# EAGLE design PIN2DMD-v3.0 (EAGLE 7.4.0)
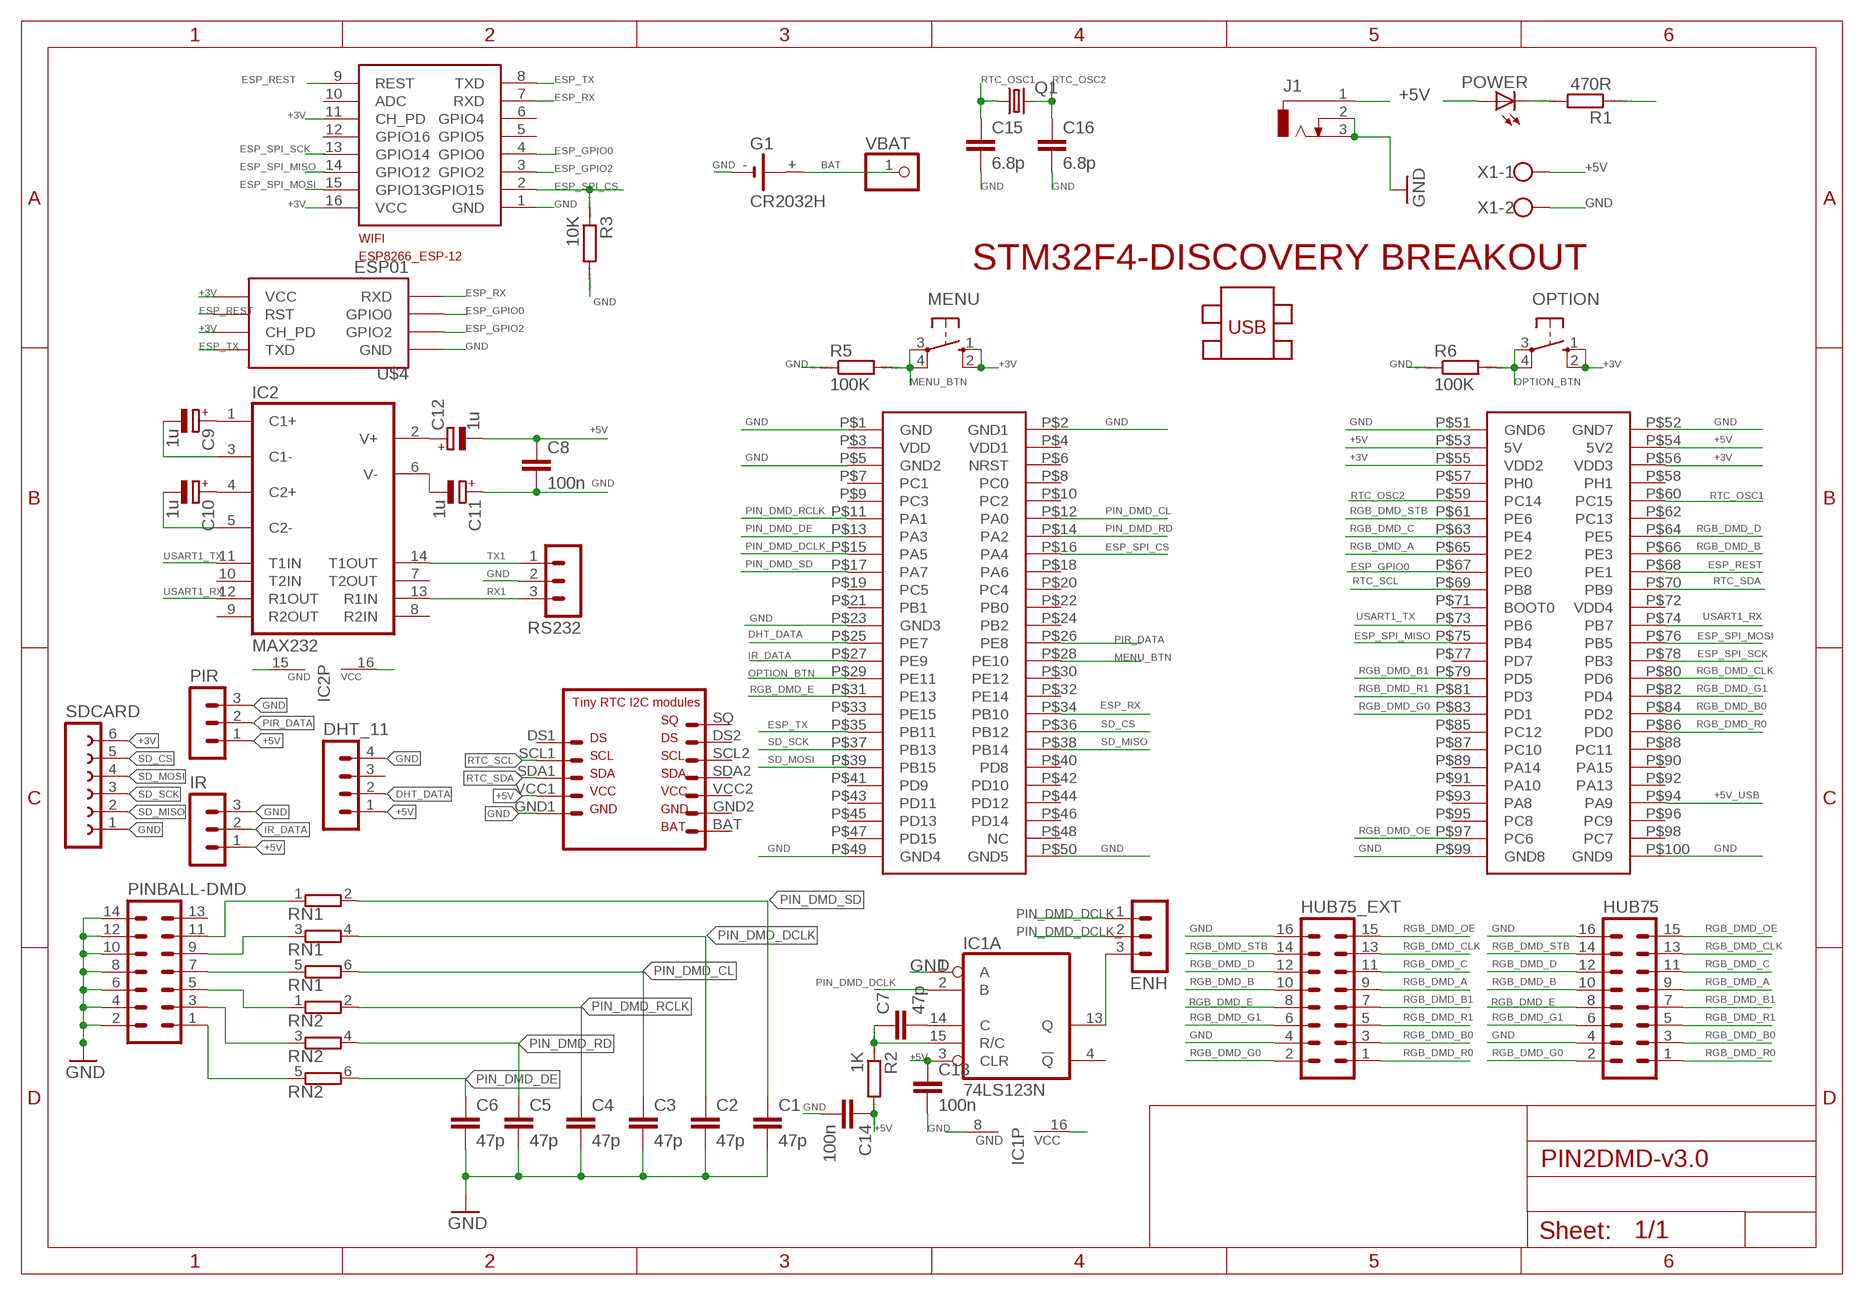
[diagram p0: schematic, sheet 1]

## Parts
C1  47p  C-EU025-024X044  [C025-024X044]
C2  47p  C-EU025-024X044  [C025-024X044]
C3  47p  C-EU025-024X044  [C025-024X044]
C4  47p  C-EU025-024X044  [C025-024X044]
C5  47p  C-EU025-024X044  [C025-024X044]
C6  47p  C-EU025-024X044  [C025-024X044]
C7  47p  C-EU025-024X044  [C025-024X044]
C8  100n  C-EU025-024X044  [C025-024X044]
C9  1u  CPOL-EUE2-4  [E2-4]
C10  1u  CPOL-EUE2-4  [E2-4]
C11  1u  CPOL-EUE2-4  [E2-4]
C12  1u  CPOL-EUE2-4  [E2-4]
C13  100n  C-EU025-024X044  [C025-024X044]
C14  100n  C-EU025-024X044  [C025-024X044]
C15  6.8p  C-EU025-024X044  [C025-024X044]
C16  6.8p  C-EU025-024X044  [C025-024X044]
DHT_11  MA04-1  [MA04-1]
ENH  MA03-1  [MA03-1]
G1  CR2032H  [CR2032H]
HUB75  MA08-2  [MA08-2]
HUB75_EXT  MA08-2  [MA08-2]
IC1  74LS123N  [DIL16]
IC2  MAX232  [DIL16]
IR  MA03-1  [MA03-1]
J1  DCJ0303  [DCJ0303]
MENU  10-XX  [B3F-10XX]
OPTION  10-XX  [B3F-10XX]
PINBALL-DMD  MA07-2  [MA07-2]
PIR  MA03-1  [MA03-1]
POWER  LED3MM  [LED3MM]
Q1  CRYSTALTC38H  [TC38H]
R1  470R  R0207/10  [0207/10]
R2  1K  R0207/10  [0207/10]
R3  10K  R0207/10  [0207/10]
R5  100K  R0207/10  [0207/10]
R6  100K  R0207/10  [0207/10]
RN1  E3RP  [SIL6]
RN2  E3RP  [SIL6]
RS232  MA03-1  [MA03-1]
SDCARD  FE06-1  [FE06]
U$1  STM32F4-DISCOVERY  [STM32F4-DISCOVERY]
U$3  RTC  [RTC]
U$4  ESP01  [ESP01]
VBAT  PINHD-1X1  [1X01]
WIFI  ESP8266_ESP-12  [ESP8266-ESP12]
X1  W237-102  [W237-102]

## Nets
+3V: MENU.1(S) MENU.2(S1) OPTION.1(S) OPTION.2(S1) SDCARD.6 U$1.P$55(VDD2) U$1.P$56(VDD3) U$4.CH_PD U$4.VCC WIFI.11(CH_PD) WIFI.16(VCC)
+5V: C8.1 C12.- C13.1 C14.1 DHT_11.1 IC1.3(A:CLR) IC1.16(P:VCC) IC2.16(VCC) IR.1 J1.1 PIR.1 POWER.A R2.2 U$1.P$53(5V) U$1.P$54(5V2) U$3.VCC1 X1.1
+5V_USB: U$1.P$94(PA9)
BAT: G1.+ VBAT.1
DHT_DATA: DHT_11.2 U$1.P$25(PE7)
ESP_GPIO0: U$1.P$67(PE0) U$4.GPIO0 WIFI.4(GPIO0)
ESP_GPIO2: U$4.GPIO2 WIFI.3(GPIO2)
ESP_REST: U$1.P$68(PE1) U$4.RST WIFI.9(REST)
ESP_RX: U$1.P$34(PB10) U$4.RX(RXD) WIFI.7(RXD)
ESP_SPI_CS: R3.1 U$1.P$16(PA4) WIFI.2(GPIO15)
ESP_SPI_MISO: U$1.P$75(PB4) WIFI.14(GPIO12)
ESP_SPI_MOSI: U$1.P$76(PB5) WIFI.15(GPIO13)
ESP_SPI_SCK: U$1.P$78(PB3) WIFI.13(GPIO14)
ESP_TX: U$1.P$35(PB11) U$4.TX(TXD) WIFI.8(TXD)
GND: C1.2 C2.2 C3.2 C4.2 C5.2 C6.2 C8.2 C11.+ C13.2 C14.2 C15.2 C16.2 DHT_11.4 G1.- HUB75.4 HUB75.16 HUB75_EXT.4 HUB75_EXT.16 IC1.1(A:A) IC1.8(P:GND) IC2.15(GND) IR.3 J1.2 J1.3 PINBALL-DMD.2 PINBALL-DMD.4 PINBALL-DMD.6 PINBALL-DMD.8 PINBALL-DMD.10 PINBALL-DMD.12 PINBALL-DMD.14 PIR.3 R1.1 R3.2 R5.1 R6.1 RS232.2 SDCARD.1 U$1.P$1(GND) U$1.P$2(GND1) U$1.P$5(GND2) U$1.P$23(GND3) U$1.P$49(GND4) U$1.P$50(GND5) U$1.P$51(GND6) U$1.P$52(GND7) U$1.P$99(GND8) U$1.P$100(GND9) U$3.GND1 U$4.GND WIFI.1(GND) X1.2
IR_DATA: IR.2 U$1.P$27(PE9)
MENU_BTN: MENU.3(P) MENU.4(P1) R5.2 U$1.P$28(PE10)
N$1: POWER.K(C) R1.2
N$2: C7.1 IC1.15(A:R/C) R2.1
N$3: C7.2 IC1.14(A:C)
N$4: C9.+ IC2.1(C1+)
N$5: PINBALL-DMD.7 RN1.5
N$6: PINBALL-DMD.5 RN2.1
N$7: C10.+ IC2.4(C2+)
N$8: C11.- IC2.6(V-)
N$9: C9.- IC2.3(C1-)
N$10: C10.- IC2.5(C2-)
N$11: PINBALL-DMD.3 RN2.3
N$12: PINBALL-DMD.1 RN2.5
N$13: PINBALL-DMD.9 RN1.3
N$14: PINBALL-DMD.11 RN1.1
N$16: C12.+ IC2.2(V+)
N$17: ENH.3 IC1.13(A:Q)
OPTION_BTN: OPTION.3(P) OPTION.4(P1) R6.2 U$1.P$29(PE11)
PIN_DMD_CL: C3.1 RN1.6 U$1.P$12(PA0)
PIN_DMD_DCLK: C2.1 ENH.1 IC1.2(A:B) RN1.4
PIN_DMD_DCLK_: ENH.2 U$1.P$15(PA5)
PIN_DMD_DE: C6.1 RN2.6 U$1.P$13(PA3)
PIN_DMD_RCLK: C4.1 RN2.2 U$1.P$11(PA1)
PIN_DMD_RD: C5.1 RN2.4 U$1.P$14(PA2)
PIN_DMD_SD: C1.1 RN1.2 U$1.P$17(PA7)
PIR_DATA: PIR.2 U$1.P$26(PE8)
RGB_DMD_A: HUB75.9 HUB75_EXT.9 U$1.P$65(PE2)
RGB_DMD_B: HUB75.10 HUB75_EXT.10 U$1.P$66(PE3)
RGB_DMD_B0: HUB75.3 HUB75_EXT.3 U$1.P$84(PD2)
RGB_DMD_B1: HUB75.7 HUB75_EXT.7 U$1.P$79(PD5)
RGB_DMD_C: HUB75.11 HUB75_EXT.11 U$1.P$63(PE4)
RGB_DMD_CLK: HUB75.13 HUB75_EXT.13 U$1.P$80(PD6)
RGB_DMD_D: HUB75.12 HUB75_EXT.12 U$1.P$64(PE5)
RGB_DMD_E: HUB75.8 HUB75_EXT.8 U$1.P$31(PE13)
RGB_DMD_G0: HUB75.2 HUB75_EXT.2 U$1.P$83(PD1)
RGB_DMD_G1: HUB75.6 HUB75_EXT.6 U$1.P$82(PD4)
RGB_DMD_OE: HUB75.15 HUB75_EXT.15 U$1.P$97(PC6)
RGB_DMD_R0: HUB75.1 HUB75_EXT.1 U$1.P$86(PD0)
RGB_DMD_R1: HUB75.5 HUB75_EXT.5 U$1.P$81(PD3)
RGB_DMD_STB: HUB75.14 HUB75_EXT.14 U$1.P$61(PE6)
RTC_OSC1: C15.1 Q1.1 U$1.P$60(PC15)
RTC_OSC2: C16.1 Q1.2 U$1.P$59(PC14)
RTC_SCL: U$1.P$69(PB8) U$3.SCL1
RTC_SDA: U$1.P$70(PB9) U$3.SDA1
RX1: IC2.13(R1IN) RS232.3
SD_CS: SDCARD.5 U$1.P$36(PB12)
SD_MISO: SDCARD.2 U$1.P$38(PB14)
SD_MOSI: SDCARD.4 U$1.P$39(PB15)
SD_SCK: SDCARD.3 U$1.P$37(PB13)
TX1: IC2.14(T1OUT) RS232.1
USART1_RX: IC2.12(R1OUT) U$1.P$74(PB7)
USART1_TX: IC2.11(T1IN) U$1.P$73(PB6)
Unconnected: DHT_11.3 G1.+@1(+) IC1.4(A:!Q) IC1.5(B:Q) IC1.6(B:C) IC1.7(B:R/C) IC1.9(B:A) IC1.10(B:B) IC1.11(B:CLR) IC1.12(B:!Q) IC2.7(T2OUT) IC2.8(R2IN) IC2.9(R2OUT) IC2.10(T2IN) PINBALL-DMD.13 U$1.P$3(VDD) U$1.P$4(VDD1) U$1.P$6(NRST) U$1.P$7(PC1) U$1.P$8(PC0) U$1.P$9(PC3) U$1.P$10(PC2) U$1.P$18(PA6) U$1.P$19(PC5) U$1.P$20(PC4) U$1.P$21(PB1) U$1.P$22(PB0) U$1.P$24(PB2) U$1.P$30(PE12) U$1.P$32(PE14) U$1.P$33(PE15) U$1.P$40(PD8) U$1.P$41(PD9) U$1.P$42(PD10) U$1.P$43(PD11) U$1.P$44(PD12) U$1.P$45(PD13) U$1.P$46(PD14) U$1.P$47(PD15) U$1.P$48(NC) U$1.P$57(PH0) U$1.P$58(PH1) U$1.P$62(PC13) U$1.P$71(BOOT0) U$1.P$72(VDD4) U$1.P$77(PD7) U$1.P$85(PC12) U$1.P$87(PC10) U$1.P$88(PC11) U$1.P$89(PA14) U$1.P$90(PA15) U$1.P$91(PA10) U$1.P$92(PA13) U$1.P$93(PA8) U$1.P$95(PC8) U$1.P$96(PC9) U$1.P$98(PC7) U$3.BAT U$3.DS1 U$3.DS2 U$3.GND2 U$3.SCL2 U$3.SDA2 U$3.SQ U$3.VCC2 WIFI.5(GPIO5) WIFI.6(GPIO4) WIFI.10(ADC) WIFI.12(GPIO16)

## Library data of the parts
C1-C8 C13-C16 = resistor:C-EU: CAPACITOR, European symbol
C9-C12 = resistor:CPOL-EU: POLARIZED CAPACITOR, European symbol
DHT_11 = con-lstb:MA04-1: PIN HEADER; OC_FARNELL: unknown; OC_NEWARK: unknown
ENH IR PIR RS232 = con-lstb:MA03-1: PIN HEADER; OC_FARNELL: unknown; OC_NEWARK: unknown
G1 = battery:CR2032H: LI BATTERY Varta
HUB75 HUB75_EXT = con-lstb:MA08-2: PIN HEADER; OC_FARNELL: unknown; OC_NEWARK: unknown
IC1 = 74xx-eu:74*123: Retriggerable monostable MULTIVIBRATOR
IC2 = maxim:MAX232: RS232 TRANSCEIVER; MF: MAXIM; MPN: MAX232ACPE+; OC_FARNELL: 9723773; OC_NEWARK: 68K4544
J1 = con-jack:DCJ0303: DC POWER JACK Source: DCJ0303.pdf; OC_FARNELL: unknown; OC_NEWARK: unknown
MENU OPTION = switch-omron:10-XX: OMRON SWITCH; MPN: B3F-1000; OC_FARNELL: 176432; OC_NEWARK: 36M3542
PINBALL-DMD = con-lstb:MA07-2: PIN HEADER
POWER = led:LED: LED OSRAM: - CHIPLED LG R971, LG N971, LY N971, LG Q971, LY Q971, LO R971, LY R971 LH N974, LH R974 LS Q976, LO Q976, LY Q976 LO Q996 - Hyper CHIPLED LW Q18S LB Q993, LB Q99A, LB R99A - SideLED LS A670, LO A670, LY A670, LG A670, LP A670 LB A673, LV A673, LT A673, LW A673 LH A674 LY A675 LS A676, LA A676, LO A676, LY A676, LW A676 LS A679, LY A679, LG A679 - Hyper Micro SIDELED® LS Y876, LA Y876, LO Y876, LY Y876 LT Y87S - SmartLED LW L88C, LW L88S LB L89C, LB L89S, LG L890 LS L89K, LO L89K, LY L89K LS L896, LA L896, LO L896, LY L896 - TOPLED LS T670, LO T670, LY T670, LG T670, LP T670 LSG T670, LSP T670, LSY T670, LOP T670, LYG T670 LG T671, LOG T671, LSG T671 LB T673, LV T673, LT T673, LW T673 LH T674 LS T676, LA T676, LO T676, LY T676, LB T676, LH T676, LSB T676, LW T676 LB T67C, LV T67C, LT T67C, LS T67K, LO T67K, LY T67K, LW E67C LS E67B, LA E67B, LO E67B, LY E67B, LB E67C, LV E67C, LT E67C LW T67C LS T679, LY T679, LG T679 LS T770, LO T770, LY T770, LG T770, LP T770 LB T773, LV T773, LT T773, LW T773 LH T774 LS E675, LA E675, LY E675, LS T675 LS T776, LA T776, LO T776, LY T776, LB T776 LHGB T686 LT T68C, LB T68C - Hyper Mini TOPLED® LB M676 - Mini TOPLED Santana® LG M470 LS M47K, LO M47K, LY M47K Source: http://www.osram.convergy.de LUXEON: - LUMILED® LXK2-PW12-R00, LXK2-PW12-S00, LXK2-PW14-U00, LXK2-PW14-V00 LXK2-PM12-R00, LXK2-PM12-S00, LXK2-PM14-U00 LXK2-PE12-Q00, LXK2-PE12-R00, LXK2-PE12-S00, LXK2-PE14-T00, LXK2-PE14-U00 LXK2-PB12-K00, LXK2-PB12-L00, LXK2-PB12-M00, LXK2-PB14-N00, LXK2-PB14-P00, LXK2-PB14-Q00 LXK2-PR12-L00, LXK2-PR12-M00, LXK2-PR14-Q00, LXK2-PR14-R00 LXK2-PD12-Q00, LXK2-PD12-R00, LXK2-PD12-S00 LXK2-PH12-R00, LXK2-PH12-S00 LXK2-PL12-P00, LXK2-PL12-Q00, LXK2-PL12-R00 Source: www.luxeon.com KINGBRIGHT: KA-3528ASYC Source: www.kingbright.com
Q1 = crystal:CRYSTAL: CRYSTAL; OC_FARNELL: unknown; OC_NEWARK: unknown
R1-R3 R5 R6 = eagle-ltspice:R: RESISTOR, European symbol; SPICEMODEL: NONE; SPICEPREFIX: R
RN1 RN2 = resistor-sil:E3RP: SIL RESISTOR; OC_FARNELL: unknown; OC_NEWARK: unknown
SDCARD = con-lsta:FE06-1: FEMALE HEADER; OC_FARNELL: unknown; OC_NEWARK: unknown
U$1 = STM32F4-DISCOVERY:STM32F4-DISCOVERY
U$3 = RTC:RTC
U$4 = esp8266modules:ESP01: ESP8266 Wifi module 01
VBAT = pinhead:PINHD-1X1: PIN HEADER
WIFI = ESP8266-ESP12:ESP8266_ESP-12
X1 = con-wago-500:W237-102: WAGO SCREW CLAMP; MPN: 237-102; OC_FARNELL: unknown; OC_NEWARK: 70K9898

## Board
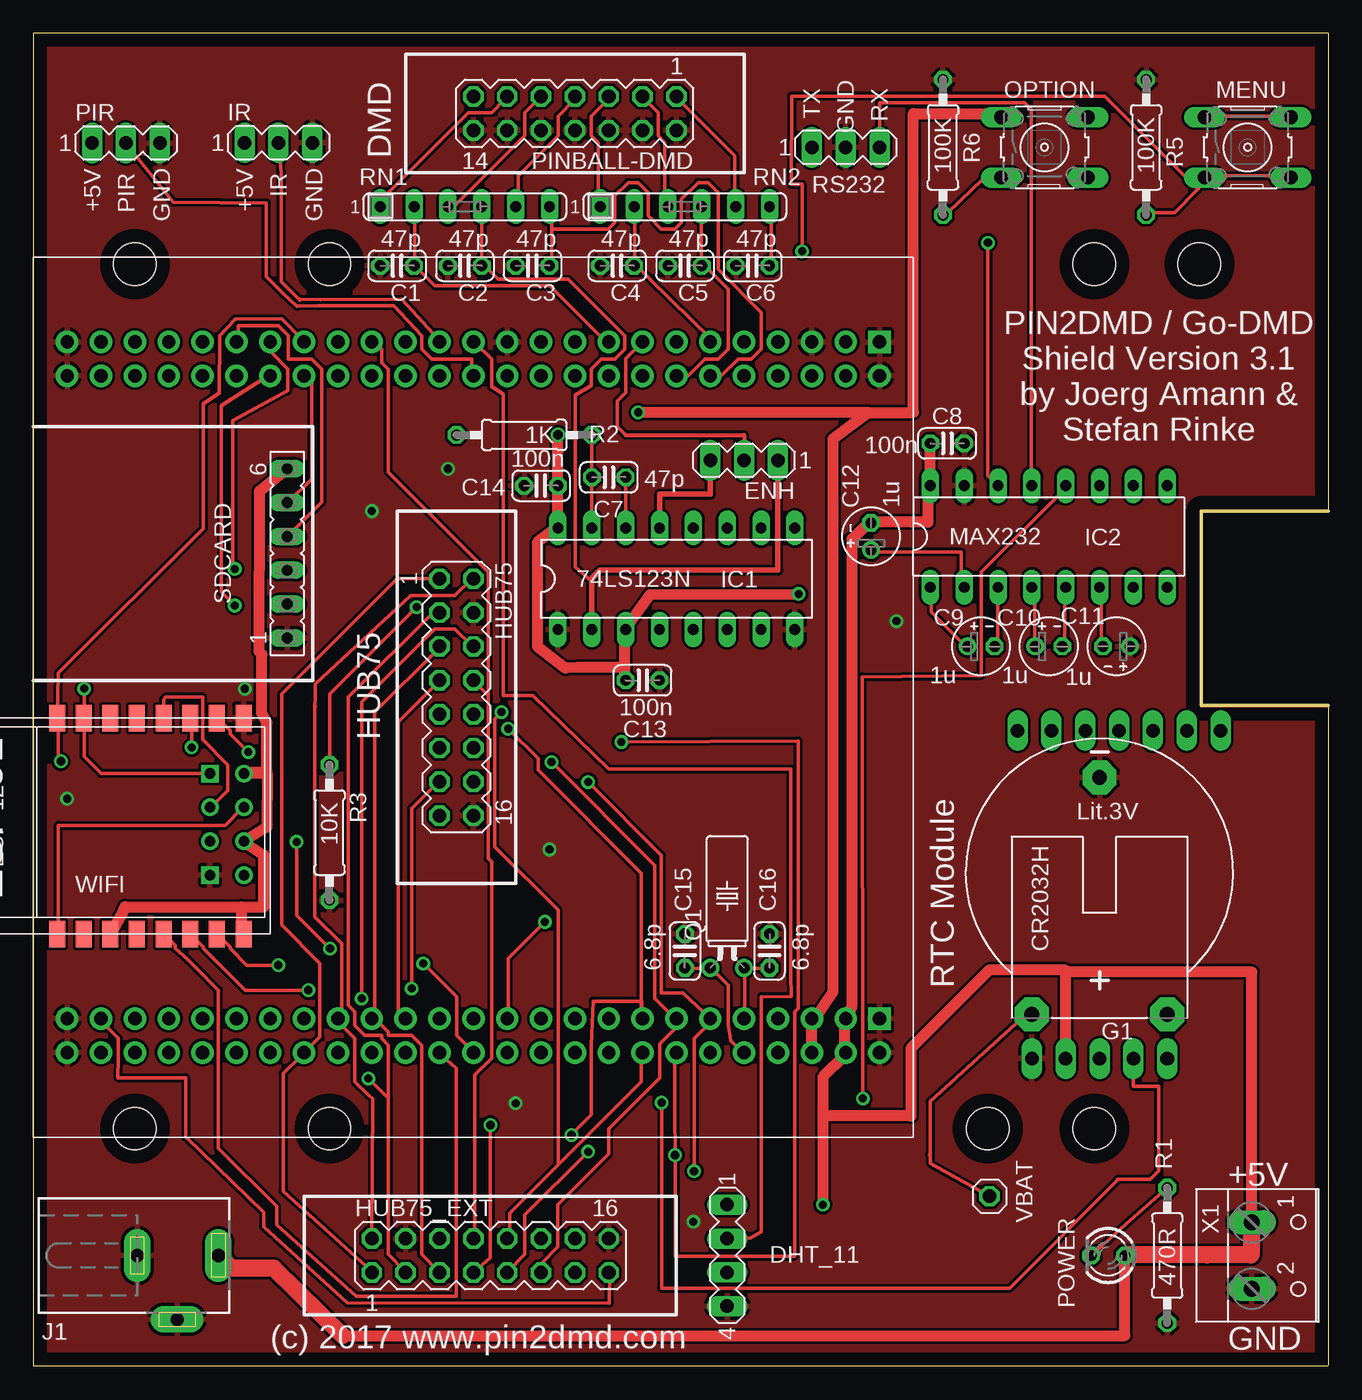
[diagram p1: board, top side]
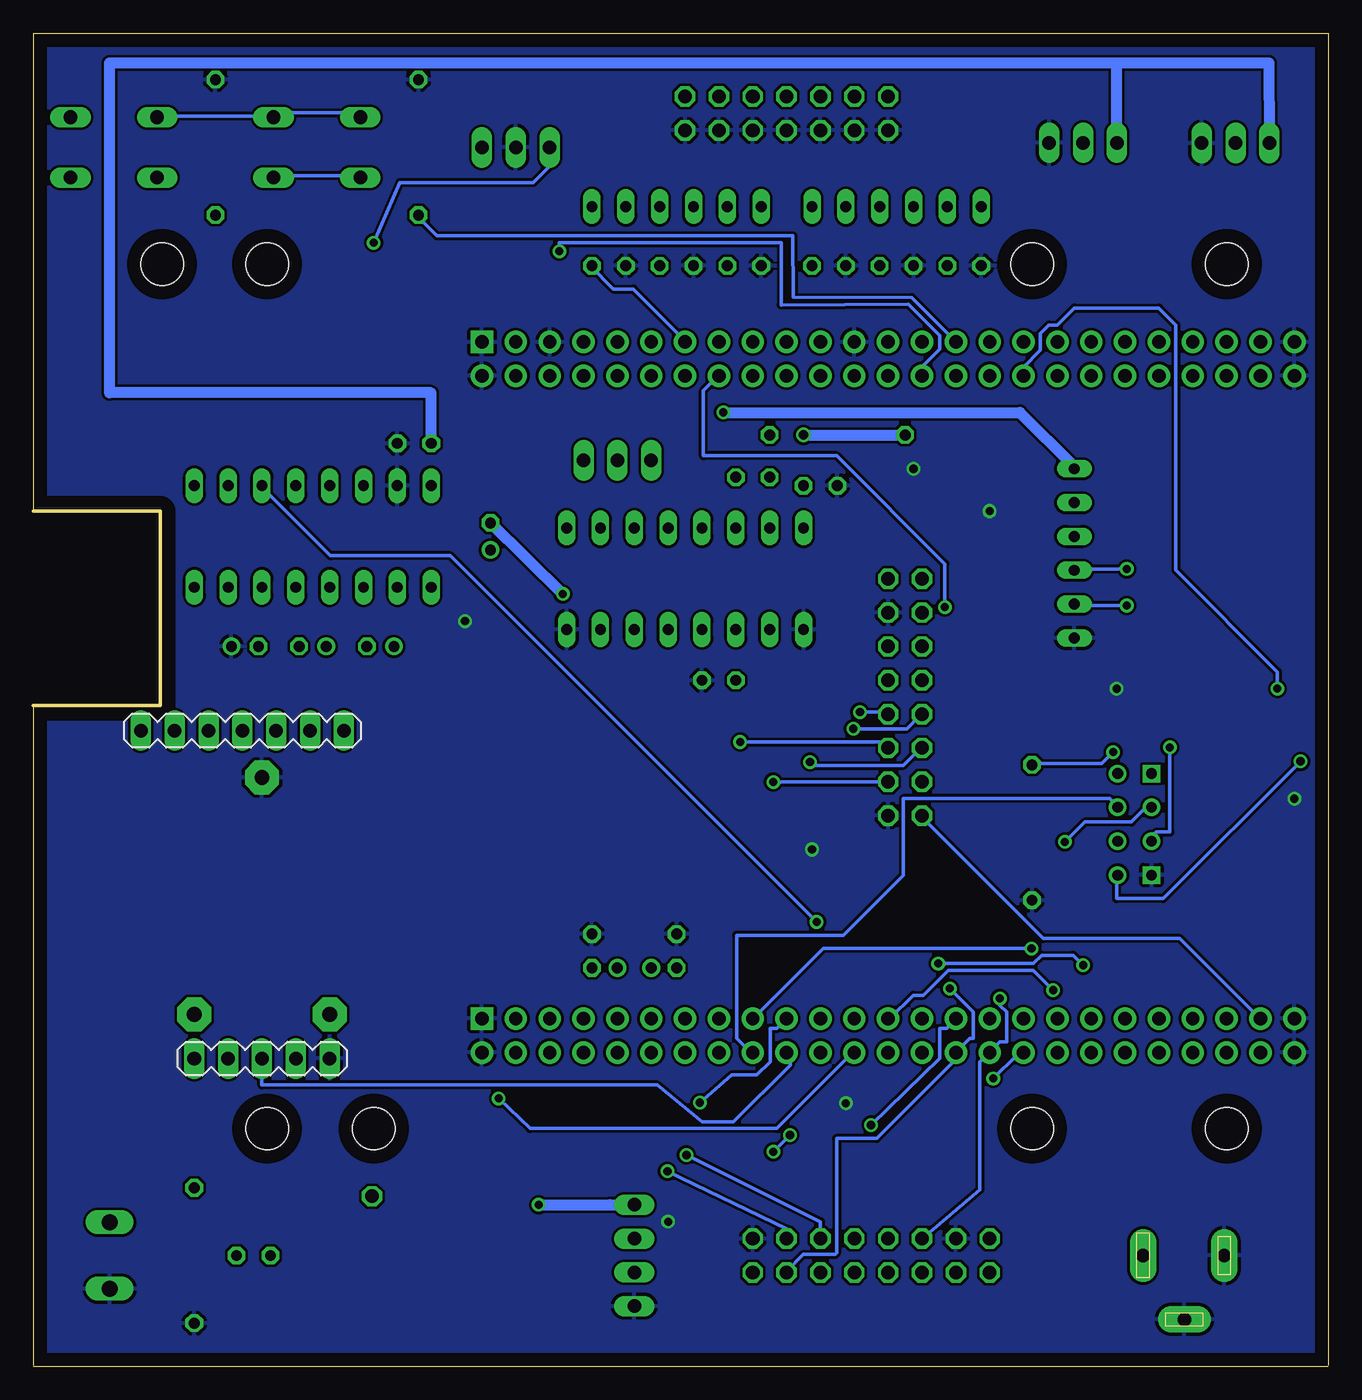
[diagram p2: board, bottom side, seen from below]

Size 97.17 x 100.06 mm. Coordinates in mm from the lower left corner, seen from the top.
Outline: 0,0.06 0,100.06 97.16,100.06 97.16,64.19 87.63,64.19 87.63,49.59 97.16,49.59 97.16,0.06
Outline: 97.17,0 0.01,0
Copper layers (1*16): Top 0.035mm / dielectric 1.5mm / Bottom 0.035mm
Design rules "default": minimum track width 10mil, minimum drill 24mil, track to track 8mil, track to pad 8mil, pad to pad 8mil, via to via 8mil, smd to smd 8mil, copper to edge 40mil, drill to drill 8mil, minimum pad ring 10mil, minimum via ring 8mil, stop-mask expansion 4mil, vias tented up to drill 0mil, thermal gap 10mil
Holes 3.2 mm at 22.23,82.73 22.23,17.84 79.63,17.84 79.63,82.73 7.62,82.73 7.62,17.84 87.5,82.73 71.63,17.84

### Footprints (pad centres in the part's own frame; a part is rotated, then mirrored left to right if it is on the bottom)
C025-024X044 = drill 0.813 octagon: 1 -1.27,0; 2 1.27,0
E2-4 = drill 0.813 pad 1.27: + -1.016,0 | drill 0.813 pad 1.27 octagon: - 1.016,0
MA04-1 = drill 1.016 long: 1 -3.81,0; 2 -1.27,0; 3 1.27,0; 4 3.81,0
MA03-1 = drill 1.016 long: 1 -2.54,0; 2 0,0; 3 2.54,0
CR2032H = drill 1.118 pad 2.54 octagon: + 5.08,10.795; +@1 -5.08,10.795; - 0,-6.985
MA08-2 = drill 1.016 octagon: 1 -8.89,-1.27; 2 -8.89,1.27; 3 -6.35,-1.27; 4 -6.35,1.27; 5 -3.81,-1.27; 6 -3.81,1.27; 7 -1.27,-1.27; 8 -1.27,1.27; 9 1.27,-1.27; 10 1.27,1.27; 11 3.81,-1.27; 12 3.81,1.27; 13 6.35,-1.27; 14 6.35,1.27; 15 8.89,-1.27; 16 8.89,1.27
DIL16 = drill 0.813 long: 1 -8.89,-3.81; 2 -6.35,-3.81; 3 -3.81,-3.81; 4 -1.27,-3.81; 5 1.27,-3.81; 6 3.81,-3.81; 7 6.35,-3.81; 8 8.89,-3.81; 9 8.89,3.81; 10 6.35,3.81; 11 3.81,3.81; 12 1.27,3.81; 13 -1.27,3.81; 14 -3.81,3.81; 15 -6.35,3.81; 16 -8.89,3.81
DCJ0303 = drill 1 pad 2 long: 1 0,3.1; 2 4.8,0; 3 0,-3
B3F-10XX = drill 1.016 long: 1 -3.251,2.261; 2 3.251,2.261; 3 -3.251,-2.261; 4 3.251,-2.261
MA07-2 = drill 1.016 octagon: 1 -7.62,-1.27; 2 -7.62,1.27; 3 -5.08,-1.27; 4 -5.08,1.27; 5 -2.54,-1.27; 6 -2.54,1.27; 7 0,-1.27; 8 0,1.27; 9 2.54,-1.27; 10 2.54,1.27; 11 5.08,-1.27; 12 5.08,1.27; 13 7.62,-1.27; 14 7.62,1.27
LED3MM = drill 0.813 octagon: A -1.27,0; K 1.27,0
TC38H = drill 0.813: 1 -1.27,0; 2 1.27,0
0207/10 = drill 0.813 octagon: 1 -5.08,0; 2 5.08,0
SIL6 = drill 0.813 long: 1 -6.35,0; 2 -3.81,0; 3 -1.27,0; 4 1.27,0; 5 3.81,0; 6 6.35,0
FE06 = drill 0.813 long: 1 -6.35,0; 2 -3.81,0; 3 -1.27,0; 4 1.27,0; 5 3.81,0; 6 6.35,0
STM32F4-DISCOVERY = drill 1 pad 1.676 square: P$1 -27.94,30.48; P$51 22.86,30.48 | drill 1 pad 1.676: P$2 -25.4,30.48; P$3 -27.94,27.94; P$4 -25.4,27.94; P$5 -27.94,25.4; P$6 -25.4,25.4; P$7 -27.94,22.86; P$8 -25.4,22.86; P$9 -27.94,20.32; P$10 -25.4,20.32; P$11 -27.94,17.78; P$12 -25.4,17.78; P$13 -27.94,15.24; P$14 -25.4,15.24; P$15 -27.94,12.7; P$16 -25.4,12.7; P$17 -27.94,10.16; P$18 -25.4,10.16; P$19 -27.94,7.62; P$20 -25.4,7.62; P$21 -27.94,5.08; P$22 -25.4,5.08; P$23 -27.94,2.54; P$24 -25.4,2.54; P$25 -27.94,0; P$26 -25.4,0; P$27 -27.94,-2.54; P$28 -25.4,-2.54; P$29 -27.94,-5.08; P$30 -25.4,-5.08; P$31 -27.94,-7.62; P$32 -25.4,-7.62; P$33 -27.94,-10.16; P$34 -25.4,-10.16; P$35 -27.94,-12.7; P$36 -25.4,-12.7; P$37 -27.94,-15.24; P$38 -25.4,-15.24; P$39 -27.94,-17.78; P$40 -25.4,-17.78; P$41 -27.94,-20.32; P$42 -25.4,-20.32; P$43 -27.94,-22.86; P$44 -25.4,-22.86; P$45 -27.94,-25.4; P$46 -25.4,-25.4; P$47 -27.94,-27.94; P$48 -25.4,-27.94; P$49 -27.94,-30.48; P$50 -25.4,-30.48; P$52 25.4,30.48; P$53 22.86,27.94; P$54 25.4,27.94; P$55 22.86,25.4; P$56 25.4,25.4; P$57 22.86,22.86; P$58 25.4,22.86; P$59 22.86,20.32; P$60 25.4,20.32; P$61 22.86,17.78; P$62 25.4,17.78; P$63 22.86,15.24; P$64 25.4,15.24; P$65 22.86,12.7; P$66 25.4,12.7; P$67 22.86,10.16; P$68 25.4,10.16; P$69 22.86,7.62; P$70 25.4,7.62; P$71 22.86,5.08; P$72 25.4,5.08; P$73 22.86,2.54; P$74 25.4,2.54; P$75 22.86,0; P$76 25.4,0; P$77 22.86,-2.54; P$78 25.4,-2.54; P$79 22.86,-5.08; P$80 25.4,-5.08; P$81 22.86,-7.62; P$82 25.4,-7.62; P$83 22.86,-10.16; P$84 25.4,-10.16; P$85 22.86,-12.7; P$86 25.4,-12.7; P$87 22.86,-15.24; P$88 25.4,-15.24; P$89 22.86,-17.78; P$90 25.4,-17.78; P$91 22.86,-20.32; P$92 25.4,-20.32; P$93 22.86,-22.86; P$94 25.4,-22.86; P$95 22.86,-25.4; P$96 25.4,-25.4; P$97 22.86,-27.94; P$98 25.4,-27.94; P$99 22.86,-30.48; P$100 25.4,-30.48
RTC = drill 1.016 long: BAT 25.75,7.82; DS1 1.13,19.05; DS2 25.75,20.52; GND1 1.13,8.89; GND2 25.75,10.36; SCL1 1.13,16.51; SCL2 25.75,17.98; SDA1 1.13,13.97; SDA2 25.75,15.44; SQ 25.75,23.06; VCC1 1.13,11.43; VCC2 25.75,12.9
ESP01 = drill 0.8: CH_PD -1.285,-8.178; GPIO0 1.255,-5.638; GPIO2 -1.285,-5.638; RST 1.255,-8.178; TX -3.825,-8.178; VCC 3.795,-8.178 | drill 0.8 square: GND -3.825,-5.638; RX 3.795,-5.638
1X01 = drill 1.016 octagon: 1 0,0
ESP8266-ESP12 = smd 2 x 1.2: 1 16.2,2; 2 16.2,4; 3 16.2,6; 4 16.2,8; 5 16.2,10; 6 16.2,12; 7 16.2,14; 8 16.2,16; 9 0,16; 10 0,14; 11 0,12; 12 0,10; 13 0,8; 14 0,6; 15 0,4; 16 0,2
W237-102 = drill 1.194 long: 1 -2.5,-1.27; 2 2.5,-1.27

### Placement (x,y rotation side)
C1  27.31,82.61 180 top
C2  32.38,82.61 180 top
C3  37.46,82.61 180 top
C4  43.81,82.61 180 top
C5  48.89,82.61 180 top
C6  53.98,82.61 180 top
C7  43.18,66.73 0 top
C8  68.58,69.27 0 top
C9  71.12,54.03 0 top
C10  76.2,54.03 0 top
C11  81.28,54.03 180 top
C12  62.86,62.29 90 top
C13  45.72,51.49 0 top
C14  38.1,66.1 180 top
C15  48.89,31.17 90 top
C16  55.24,31.17 90 top
DHT_11  52.07,8.31 270 top
ENH  53.34,68 180 top
G1  80.01,37.2 180 top
HUB75  31.75,50.22 270 top
HUB75_EXT  34.29,8.31 0 top
IC1  48.26,59.11 0 top
IC2  76.2,62.29 0 top
IR  18.4,91.84 0 top
J1  10.79,8.31 270 top
MENU  91.12,91.5 0 top
OPTION  75.88,91.5 0 top
PINBALL-DMD  40.64,94.04 180 top
PIR  6.95,91.82 0 top
POWER  80.65,8.31 180 top
Q1  52.07,29.9 0 top
R1  85.09,8.31 90 top
R2  36.83,69.91 180 top
R3  22.23,40.06 270 top
R5  83.5,91.5 270 top
R6  68.26,91.5 270 top
RN1  32.38,87.05 0 top
RN2  48.89,87.05 0 top
RS232  60.96,91.5 0 top
SDCARD  19.05,61.02 90 top
U$1  33.02,48.95 270 top
U$3  66.04,21.96 90 bottom
U$4  7.62,40.7 90 top
VBAT  71.76,12.76 0 top
WIFI  17.78,32.44 90 top
X1  92.71,8.31 270 top

### Tracks (layer width: path | path; a pad name or v marks a point on that pad's centre or on a via)
+3V  (via drill 0.61)
  Top 0.254: 18.89,67.35 SDCARD.6 | 15.88,44.6 U$4.VCC | 6.78,34.26 6.78,33.87 6.88,34.49 | 5.88,32.6 WIFI.11 | 15.63,32.6 WIFI.16 | MENU.1 88.39,93.85 94.32,93.85 MENU.2 | 58.38,23.6 U$1.P$56 | 58.38,25.85 U$1.P$55 58.63,26.1 | 15.76,39.35 U$4.CH_PD 15.88,39.48
  Top 0.813: 6.78,34.26 5.88,32.6 | 15.63,32.6 15.63,34.49 | 58.38,25.85 58.38,23.6 | 58.63,26.1 60,28.1 60,69.6 62.63,71.6 | 62.63,71.6 v45.38,71.6 | 15.76,39.35 17.3,38.35 17.3,34.49 15.63,34.49 | 15.88,39.48 17.52,40.48 17.54,44.5 U$4.VCC | 6.88,34.49 15.63,34.49 | 15.88,44.6 17.53,44.62 17.53,48.32 17.15,48.95 17.15,53.4 16.95,53.67 16.98,65.71 SDCARD.6 | 62.63,71.6 66.04,71.6 66.04,94.04 72.63,94.04 OPTION.1
  Bottom 0.254: OPTION.1 73.14,93.85 73.39,94.1 77.89,94.1 78.14,93.85 79.39,93.85 OPTION.2 79.64,93.85 87.82,93.85 MENU.1
  Bottom 0.813: v45.38,71.6 23.14,71.6 19.14,67.6 SDCARD.6
+5V  (via drill 0.61, 0.7)
  Top 0.254: 39.13,62.85 IC1.16 | 60.88,23.35 U$1.P$54 60.88,23.6 | 60.88,25.85 U$1.P$53 | 81.98,8.35 POWER.A | 88.08,8.35 POWER.A | 83.64,8.1 POWER.A | 44.63,55.67 IC1.3 44.38,55.1 | 44.38,51.6 C13.1 | X1.1 91.64,10.85 91.39,10.6
  Top 0.813: 39.13,62.85 37.82,61.85 37.82,54.03 39.93,52.41 40.88,52.47 44.38,52.47 | v59.24,12.13 v59.25,12.13 59.25,18.78 | 59.25,18.78 59.25,21.72 60.88,23.35 | 60.88,23.6 60.88,25.85 | U$1.P$53 61.45,27.05 61.45,62.1 62.45,63.1 C12.- 63.02,63.35 67.14,63.35 67.14,65.85 IC2.16 C8.1 | 14.13,8.1 J1.1 | 59.25,18.78 65.84,18.78 65.84,23.85 71.73,29.74 77.47,29.74 77.47,29.58 | 44.63,55.67 46.26,57.93 57.43,57.89 v57.43,57.97 | 44.38,51.6 44.38,52.47 | 44.38,52.47 44.38,55.1 | U$3.VCC1 77.47,29.58 | X1.1 91.44,29.58 77.47,29.58 | IC1.16 C14.1 v39.37,69.91 | 23.21,2.3 81.92,2.3 POWER.A
  Top 1.27: 81.98,8.35 88.08,8.35 91.39,8.35 91.39,10.6 | 14.13,8.1 14.88,7.35 18.06,7.36 23.21,2.3
  Bottom 0.254: 52.12,12.11 DHT_11.1
  Bottom 0.813: 52.12,12.11 53.88,12.12 v59.24,12.13 | v57.43,57.97 62.91,63.35 62.77,63.35 C12.- | v39.37,69.91 R2.2 | 15.88,97.85 91.44,97.85 91.44,73.08 67.31,73.08 C8.1 | 15.88,97.85 4.45,97.85 4.43,92.13 | 4.43,92.13 4.43,91.87 | 15.88,97.85 15.88,91.84 IR.1 | PIR.1 4.43,91.82 4.43,92.13
BAT
  Top 0.254: 67.3,15.87 67.3,19.88 74.14,26.08 G1.+ | 67.23,15.87 67.3,15.87 | 67.3,15.87 67.31,15.24 VBAT.1
DHT_DATA
  Top 0.254: DHT_11.2 53.84,9.62 54.63,10.1 54.63,27.74 56.88,27.76 56.83,29.4 56.83,44.82 43.18,44.82 37.48,50.35 35.27,50.35 35.27,72.97 34.38,73.53 34.38,75.6 33.13,76.85 U$1.P$25
ESP_GPIO0  (via drill 0.61)
  Top 0.254: v22.26,31.35 19.76,33.85 v19.76,39.36 v19.76,39.37 | U$4.GPIO0 13.32,41.95 14.61,43.24 14.61,45.14 12.7,47.05 12.7,50.22 9.93,50.22 9.77,50.06 WIFI.4
  Bottom 0.254: U$4.GPIO0 13.26,41.85 13.76,41.85 14.76,40.85 18.26,40.85 v19.76,39.37 | v22.26,31.35 37.88,31.35 43.13,26.1 U$1.P$67
ESP_GPIO2  (via drill 0.61)
  Top 0.254: v11.88,46.46 11.88,48.6 WIFI.3
  Bottom 0.254: v11.88,46.46 11.88,40.1 12.88,40.1 13.38,39.6 U$4.GPIO2
ESP_REST
  Top 0.254: U$4.RST 15.63,41.85 14.38,40.6 1.89,40.6 1.89,32.6 WIFI.9
  Bottom 0.254: U$1.P$68 43.38,23.6 44.38,24.6 44.38,32.35 36.38,32.35 31.89,36.85 31.89,42.6 16.39,42.6 15.88,42.1 U$4.RST
ESP_RX  (via drill 0.6)
  Top 0.254: v3.81,50.86 3.81,49.94 WIFI.7 3.81,48.61 3.81,45.78 5.09,44.49 U$4.RX
  Bottom 0.254: U$1.P$34 22.86,74.99 21.59,76.26 21.59,77.53 20.96,78.16 20.32,78.16 19.05,79.43 12.7,79.43 11.43,78.16 11.43,59.75 3.81,52.13 v3.81,50.86
ESP_SPI_CS  (via drill 0.61)
  Top 0.254: v16.14,46.1 14.76,47.48 14.76,47.73 13.88,48.6 WIFI.2 | v28.76,56.98 22.26,50.48 22.26,45.23 R3.1
  Bottom 0.254: v16.14,46.1 17.01,45.23 22.14,45.23 R3.1 | v28.76,56.98 28.76,60.23 36.88,68.35 46.88,68.35 46.88,73.23 45.76,74.35 U$1.P$16
ESP_SPI_MISO  (via drill 0.61)
  Top 0.254: v20.64,28.23 15.88,28.23 12.76,31.35 12.76,31.48 11.88,32.35 WIFI.14
  Bottom 0.254: v20.64,28.23 22.14,29.73 28.51,29.73 30.39,27.85 31.14,27.85 32.88,26.1 U$1.P$75
ESP_SPI_MOSI  (via drill 0.61)
  Top 0.254: v18.39,30.1 16.01,30.1 14.76,31.35 14.76,31.48 13.88,32.35 WIFI.15 | v29.26,30.23 31.76,27.73 31.76,24.85 33.01,23.6 U$1.P$76
  Bottom 0.254: v18.39,30.1 19.14,30.85 21.51,30.85 22.14,30.23 v29.26,30.23
ESP_SPI_SCK
  Top 0.254: WIFI.13 9.88,32.35 10.63,31.6 10.63,31.35 11.63,30.48 11.62,30.48 12.25,29.85 13.88,28.22 13.88,16.35 18.25,11.99 18.25,10.62 24.25,5.26 31.73,5.26 31.73,22.35 30.64,23.35 U$1.P$78
ESP_TX  (via drill 0.61)
  Top 0.254: 12.76,62.9 12.74,62.88 | 12.74,62.88 1.89,52.03 WIFI.8 1.89,48.6 1.89,45.6 v2.08,45.41 | U$1.P$35 20.14,77.1 18.64,78.62 15.13,78.6 13.97,77.35 13.97,73.05 12.76,72.26 12.74,62.88
  Bottom 0.254: v2.08,45.41 12.38,35.1 15.88,35.1 15.88,36.85 U$4.TX
GND  (via drill 0.61, 0.61 pad 0.61)
  Top 0.254: WIFI.1 15.76,48.73 15.76,48.54
  other vias: 15.88,50.86 25.4,64.19 31.12,67.37 2.54,42.6 38.73,38.79 49.53,10.85 64.77,55.94 36.2,19.74
  pour Bottom: 0,99.75 97.16,99.75 97.16,0.06 0,0.06
  pour Top: 0,0.06 97.16,0.06 97.16,99.75 0,99.75
IR_DATA
  Top 0.254: U$1.P$27 30.39,77.1 27.64,80.09 21.56,80.06 19.98,80.08 20.01,80.04 18.62,81.41 18.62,89.53 18.41,91.82 18.4,91.82 IR.2
MENU_BTN  (via drill 0.61)
  Top 0.254: MENU.4 94.32,89.35 88.39,89.35 MENU.3 87.82,89.1 87.39,88.35 | 87.39,88.35 85.64,86.6 83.89,86.6 R5.2 | 87.39,88.35 80.39,95.35 56.9,95.35 56.89,88.71 57.69,88.71 v57.69,83.7
  Bottom 0.254: U$1.P$28 30.39,74.35 30.39,75.1 29.14,76.35 29.14,77.35 31.5,79.72 41.05,79.66 41.05,84.35 57.69,84.35 v57.69,83.7
N$1
  Top 0.254: POWER.K 79.48,8.35 82.02,10.7 R1.2
N$2
  Top 0.254: IC1.15 C7.1 | C7.1 41.91,66.85 | 41.91,66.85 R2.1 | C7.1 41.88,66.85 41.91,66.85
N$3
  Top 0.254: IC1.14 C7.2
N$4
  Top 0.254: C9.+ 69.89,54.1 67.39,56.6 67.39,58.35 IC2.1
N$5
  Top 0.254: RN1.5 36.38,87.1 36.38,89.35 39.38,92.35 39.38,93.85 40.63,95.1 PINBALL-DMD.7
N$6
  Top 0.254: RN2.1 42.38,87.1 42.38,91.85 41.88,92.35 41.88,93.85 43.13,95.1 PINBALL-DMD.5
N$7
  Top 0.254: C10.+ 75.14,54.1 75.14,58.35 IC2.4
N$8
  Top 0.254: C11.- 80.14,54.1 80.14,58.35 IC2.6
N$9
  Top 0.254: C9.- 72.39,54.1 72.39,58.35 IC2.3
N$10
  Top 0.254: C10.- 77.39,54.1 77.39,58.35 IC2.5
N$11
  Top 0.254: RN2.3 47.38,87.1 47.38,91.85 46.88,92.35 46.88,94.1 45.88,95.1 PINBALL-DMD.3
N$12
  Top 0.254: RN2.5 52.63,87.1 52.63,90.85 48.38,95.1 PINBALL-DMD.1
N$13
  Top 0.254: RN1.3 31.14,87.1 31.64,87.1 36.88,92.35 36.88,94.1 37.88,95.1 PINBALL-DMD.9
N$14
  Top 0.254: RN1.1 26.14,87.1 26.14,87.6 32.63,94.1 34.38,94.1 35.38,95.1 PINBALL-DMD.11
N$16
  Top 0.254: C12.+ 63.02,61.1 69.64,61.1 69.64,58.6 IC2.2
N$17
  Top 0.406: IC1.13 46.99,65.46 50.8,65.46 ENH.3
OPTION_BTN
  Top 0.254: R6.2 68.64,86.6 71.3,89.14 72.57,89.1 OPTION.3
  Bottom 0.254: OPTION.4 79.39,89.35 73.14,89.35 OPTION.3 | U$1.P$29 28.14,77.1 31.25,80.22 40.16,80.25 40.16,84.85 66.89,84.85 68.39,86.35 R6.2
PIN_DMD_CL
  Top 0.254: 38.88,85.35 38.88,86.85 RN1.6 | 38.88,85.35 38.88,82.85 C3.1 | U$1.P$12 51.63,74.35 52.88,75.6 53.88,75.6 54.63,76.35 54.63,79.1 51.38,82.35 51.38,88.1 50.63,88.85 49.88,88.85 48.63,87.6 48.63,85.85 48.13,85.35 47.13,85.35 46.13,86.35 46.13,88.1 45.38,88.85 44.63,88.85 43.63,87.85 43.63,85.85 43.13,85.35 38.88,85.35
PIN_DMD_DCLK
  Top 0.254: RN1.4 33.63,86.85 33.63,82.85 C2.1 33.88,82.6 34.88,81.6 40.13,81.6 44.38,77.35 44.38,76.35 43.63,75.6 42.63,75.6 41.88,74.85 41.88,73.62 40.68,72.9 40.68,60 41.88,58.95 41.88,55.35 IC1.2
  Top 0.406: IC1.2 41.91,59.11 42.54,59.75 55.88,59.75 ENH.1
PIN_DMD_DCLK_
  Top 0.254: U$1.P$15 44.45,75.62 44.45,73.08 43.81,72.45 43.81,70.54 44.45,69.91
  Top 0.305: ENH.2 53.34,69.91 44.45,69.91
PIN_DMD_DE
  Top 0.254: C6.1 55.38,82.85 55.38,86.85 RN2.6
  Bottom 0.254: U$1.P$13 48.38,77.1 52.13,80.85 53.63,80.85 55.38,82.6 C6.1
PIN_DMD_RCLK
  Top 0.254: RN2.2 45.13,86.85 45.13,82.85 C4.1 45.29,82.6 46.29,81.6 46.31,81.58 50.88,77.1 U$1.P$11
PIN_DMD_RD
  Top 0.254: RN2.4 50.13,86.85 50.13,82.85 C5.1 50.38,82.6 52.13,80.85 52.13,76.35 51.38,75.6 50.38,75.6 49.13,74.35 U$1.P$14
PIN_DMD_SD
  Top 0.254: RN1.2 28.64,86.85 28.64,82.85 C1.1 28.64,82.6 30.14,81.1 38.77,81.1 42.77,77.1 43.13,77.1 U$1.P$17
PIR_DATA
  Top 0.254: U$1.P$26 32.88,74.35 32.88,75.6 29.89,75.6 29.14,76.35 29.14,77.35 27.06,79.61 26.43,79.6 21.39,79.6 19.8,79.58 19.77,79.57 18.75,80.5 17.47,81.78 17.48,87.32 10.49,87.39 PIR.2
RGB_DMD_A  (via drill 0.61)
  Top 0.254: v41.63,16.1 36.88,11.35 36.88,8.39 35.63,7.14 HUB75_EXT.9 | v40.38,17.35 41.88,18.85 41.88,24.1 42,27.39 45.66,27.39 45.63,26.1 | v35.63,47.85 37.88,45.6 37.88,44.74 45.63,36.99 45.63,26.1 | 45.63,26.1 U$1.P$65
  Bottom 0.254: v40.38,17.35 v41.63,16.1 | v35.63,47.85 31.64,47.85 30.64,48.85 HUB75.9
RGB_DMD_B  (via drill 0.61)
  Top 0.254: 39.38,15.1 45.63,21.35 45.63,23.35 U$1.P$66 | 39.38,15.1 35.75,11.47 35.75,9.76 35.63,9.64 HUB75_EXT.10 | v35.13,49.1 34.63,48.6 34.63,38.99 39.38,34.24 39.38,15.1
  Bottom 0.254: v35.13,49.1 33.13,49.1 HUB75.10
RGB_DMD_B0  (via drill 0.61)
  Top 0.254: 26.64,20.1 26.64,8.39 27.89,7.14 HUB75_EXT.3 | v25.14,21.6 26.64,20.1 | 26.64,20.1 26.64,24.1 26.14,24.6 26.14,24.85 24.89,24.85 24.14,25.6 24.14,26.6 23.64,27.1 23.64,50.24 30.07,56.67 HUB75.3
  Bottom 0.254: v25.14,21.6 23.39,23.35 22.89,23.35 U$1.P$84
RGB_DMD_B1  (via drill 0.61)
  Top 0.254: v34.3,18.1 34.28,8.14 33.13,7.14 HUB75_EXT.7 | HUB75.7 30.39,51.35 27.39,48.35 27.39,26.6 27.89,26.1 U$1.P$79
  Bottom 0.254: v34.3,18.1 29.14,23.1 29.14,25.35 28.64,25.35 28.14,25.85 U$1.P$79
RGB_DMD_C  (via drill 0.61)
  Top 0.254: v38.88,45.35 46.63,37.6 46.63,27.6 48.13,26.1 U$1.P$63 48.13,25.85 48.13,26.12 48.29,25.49 46.99,24.19 46.99,21.65 43.18,17.84 43.18,15.93 39.37,12.12 39.37,8.95 38.1,7.68 HUB75_EXT.11
  Bottom 0.254: v38.88,45.35 38.63,45.1 31.89,45.1 30.64,46.35 HUB75.11
RGB_DMD_CLK  (via drill 0.61)
  Top 0.254: v28.39,28.35 28.39,41.85 30.39,43.85 HUB75.13
  Bottom 0.254: HUB75_EXT.13 40.63,7.14 39.38,8.39 37,8.39 36.88,8.51 36.88,17.1 33.88,17.1 28.14,22.85 28.14,23.35 U$1.P$80 27.89,23.6 26.89,24.6 26.64,24.6 26.64,26.6 v28.39,28.35
RGB_DMD_D  (via drill 0.61)
  Top 0.254: U$1.P$64 48.13,23.35 48.13,19.01 v48.16,15.85 48.16,8.26 56.88,8.26 56.99,8.26 57.13,8.26 57.13,10.1 57.13,26.6 57.38,26.85 57.38,46.94 v44.13,46.86
  Bottom 0.254: 38.13,9.64 HUB75_EXT.12 | v44.13,46.86 37.13,46.85 33.38,46.85 33.13,46.6 HUB75.12 | 38.1,9.64 38.1,10.85 v48.16,15.85
  Bottom 0.406: 38.13,9.64 38.1,9.64
RGB_DMD_E
  Top 0.254: 34.13,50.35 34.13,38.1 34.38,37.85 34.38,23.1 33.13,21.85 33.13,9.64 HUB75_EXT.8 | 34.13,50.35 33.13,51.35 HUB75.8 | 34.13,50.35 34.13,59.6 26.64,67.1 26.64,74.85 26.14,75.35 26.14,76.35 25.64,76.85 U$1.P$31
RGB_DMD_G0
  Top 0.254: HUB75_EXT.2 25.39,9.64 25.45,20.05 25.14,20.35 24.14,21.35 24.14,24.6 22.89,25.85 U$1.P$83 | HUB75.2 32.88,59.1 31.64,57.85 28.31,57.85 21.16,51.2 arc-6 21.13,49.59 21.15,49.54 21.14,49.44 21.14,33.73 23.14,31.73 23.14,25.73 U$1.P$83 | 22.57,26.1 U$1.P$83
RGB_DMD_G1  (via drill 0.61)
  Top 0.254: v24.64,27.6 24.64,49.85 30.14,55.35 31.64,55.35 32.88,54.1 HUB75.6
  Bottom 0.254: HUB75_EXT.6 30.39,9.64 26.14,13.26 26.14,22.85 25.64,23.35 U$1.P$82 25.39,23.6 24.64,24.35 24.14,24.35 24.14,26.6 24.64,27.1 v24.64,27.6
RGB_DMD_OE
  Top 0.254: U$1.P$97 5.13,25.85 6.38,24.6 6.38,23.1 6.35,21.65 11.43,21.65 11.43,17.2 17.29,11.56 17.29,10.47 23.57,4.76 43.23,4.74 43.26,7.08 43.38,7.1 HUB75_EXT.15
  Bottom 0.254: HUB75.15 30.39,41.1 21.39,32.1 11.13,32.1 5.13,26.1 U$1.P$97
RGB_DMD_R0
  Top 0.254: HUB75_EXT.1 25.39,7.14 18.75,13.14 18.75,21.97 20.14,23.35 U$1.P$86 20.39,23.6 21.51,24.73 21.51,30.25 18.64,33.12 18.64,50.44 27.31,59.11 HUB75.1
RGB_DMD_R1
  Top 0.254: 25.64,26.1 26.64,25.1 26.64,24.85 28.39,24.85 29.14,24.1 29.14,8.39 30.39,7.14 HUB75_EXT.5 | 25.64,26.1 25.64,49.1 30.39,53.85 HUB75.5 | 25.64,26.1 U$1.P$81
RGB_DMD_STB  (via drill 0.61)
  Top 0.254: v49.58,14.64 49.59,15.81 49.59,24.6 50.88,25.85 U$1.P$61 48.73,28.01 47.13,28.01 47.13,38.35 v41.63,43.85
  Bottom 0.254: v49.58,14.64 40.57,10.28 HUB75_EXT.14 | v41.63,43.85 33.13,43.85 HUB75.14
RTC_OSC1
  Top 0.254: C15.1 49.02,29.85 50.63,29.85 Q1.1 50.88,29.85 52.13,28.6 52.13,25.6 52.32,24.47 52.32,24.42 53.13,23.6 U$1.P$60
RTC_OSC2
  Top 0.254: 53.38,29.85 55,29.85 C16.1 | 53.38,29.85 53.38,26.1 U$1.P$59 | 53.38,29.85 Q1.2
RTC_SCL  (via drill 0.61)
  Top 0.254: v47.16,19.78 47.16,5.85 73.26,5.85 81.36,13.95 81.36,14.03 83.82,14.03 84.45,14.66 84.45,21.01 82.55,21.01 U$3.SCL1
  Bottom 0.254: v47.16,19.78 44.77,21.85 42.88,21.85 41.88,22.85 41.88,25.35 41.38,25.35 40.88,25.85 U$1.P$69
RTC_SDA
  Bottom 0.254: U$1.P$70 40.63,23.35 40.38,23.35 40.38,22.6 44.63,18.35 46.97,18.35 50.36,21.1 80.01,21.1 U$3.SDA1
RX1
  Top 0.254: IC2.13 74.89,66.1 74.89,94.35 74.39,94.85 63.52,94.85 63.52,91.6 RS232.3
SD_CS
  Top 0.254: SDCARD.5 19.14,64.85 20.89,66.6 20.89,73.85 20.39,74.35 U$1.P$36
SD_MISO  (via drill 0.61)
  Top 0.254: v15.12,57.1 14.12,58.1 14.12,72.1 17.64,74.35 U$1.P$38
  Bottom 0.254: v15.12,57.1 18.89,57.1 SDCARD.2
SD_MOSI
  Top 0.254: SDCARD.4 19.14,62.35 21.64,64.85 21.64,74.85 20.89,75.6 19.14,75.6 19.14,77.35 18.39,78.1 15.38,78.1 15.38,77.1 U$1.P$39
SD_SCK  (via drill 0.61)
  Top 0.254: v15.12,59.85 14.98,60.35 14.98,70.97 19.08,73.22 19.08,74.85 17.89,76.1 17.89,76.85 U$1.P$37
  Bottom 0.254: v15.12,59.85 18.89,59.85 SDCARD.3
TX1  (via drill 0.61)
  Top 0.254: IC2.14 71.64,66.85 v71.64,84.33
  Bottom 0.254: v71.64,84.33 69.66,88.85 59.63,88.85 58.52,89.97 58.52,90.72 RS232.1
USART1_RX  (via drill 0.61)
  Top 0.254: v62.25,20.1 62.19,51.74 71.14,51.85 71.14,59.6 77.39,65.85 IC2.12
  Bottom 0.254: v62.25,20.1 59.88,17.85 41.38,17.85 35.88,23.35 35.63,23.35 U$1.P$74
USART1_TX  (via drill 0.61)
  Top 0.254: v38.38,33.35 35.63,30.6 35.63,26.1 U$1.P$73
  Bottom 0.254: v38.38,33.35 65.89,60.85 74.89,60.85 79.89,65.85 IC2.11

### Text on the board
tNames: DMD | GND | TX | RX | +5V | PIR | GND | +5V | IR | GND | PIN2DMD / Go-DMD / Shield Version 3.1 / by Joerg Amann & / Stefan Rinke | HUB75 | RTC Module | +5V | (c) 2017 www.pin2dmd.com | GND